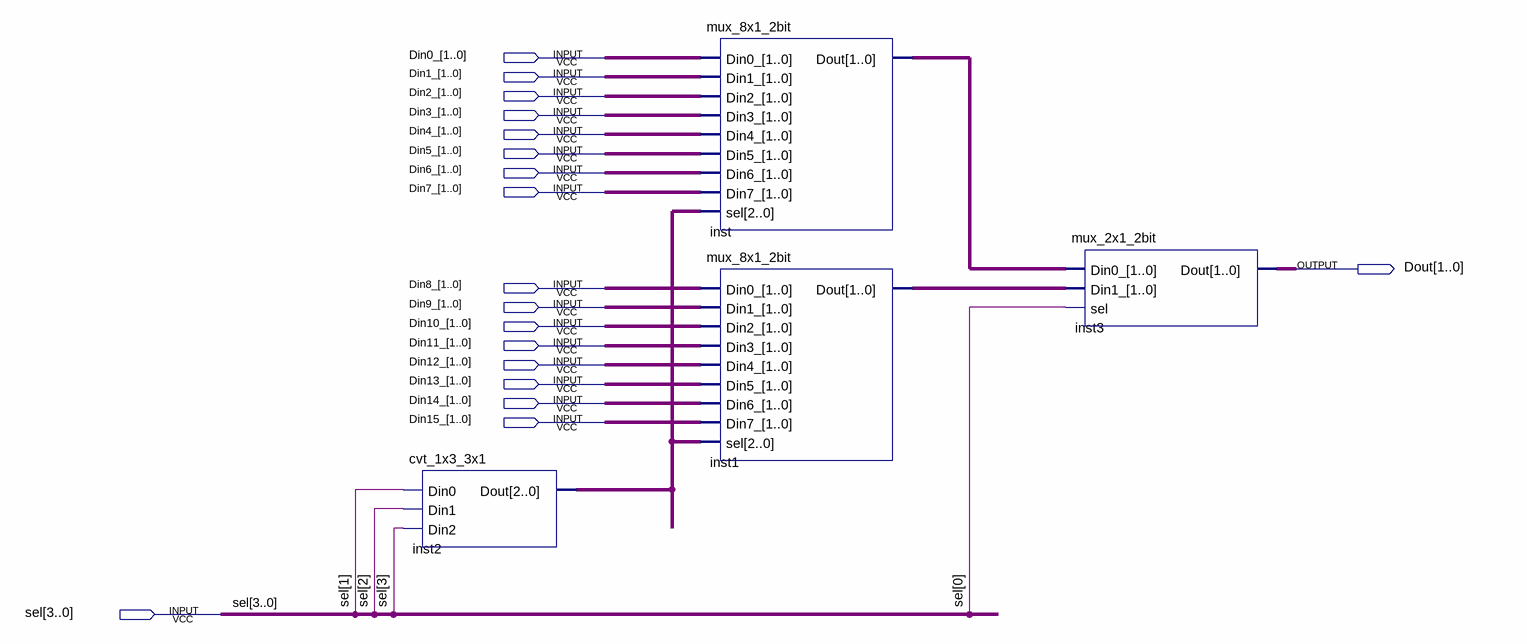
[diagram p0: schematic sheet]
// Quartus schematic mux_16x1_2bit.bdf as structural Verilog: 4 symbols, 18 pins
module mux_16x1_2bit (
  input  [1:0] Din0_,
  input  [1:0] Din1_,
  input  [1:0] Din2_,
  input  [1:0] Din3_,
  input  [1:0] Din4_,
  input  [1:0] Din5_,
  input  [1:0] Din6_,
  input  [1:0] Din7_,
  input  [1:0] Din8_,
  input  [1:0] Din9_,
  input  [1:0] Din10_,
  input  [1:0] Din11_,
  input  [1:0] Din12_,
  input  [1:0] Din13_,
  input  [1:0] Din14_,
  input  [1:0] Din15_,
  input  [3:0] sel,
  output [1:0] Dout
);

  wire [1:0] inst1_dout, inst_dout;
  wire [2:0] inst2_dout;

  cvt_1x3_3x1 inst2 (.Din0(sel[1]), .Din1(sel[2]), .Din2(sel[3]), .Dout(inst2_dout));
  mux_8x1_2bit inst (
    .Din0_(Din0_), .Din1_(Din1_), .Din2_(Din2_), .Din3_(Din3_), .Din4_(Din4_), .Din5_(Din5_), .Din6_(Din6_),
    .Din7_(Din7_), .sel(inst2_dout), .Dout(inst_dout));
  mux_8x1_2bit inst1 (
    .Din0_(Din8_), .Din1_(Din9_), .Din2_(Din10_), .Din3_(Din11_), .Din4_(Din12_), .Din5_(Din13_),
    .Din6_(Din14_), .Din7_(Din15_), .sel(inst2_dout), .Dout(inst1_dout));
  mux_2x1_2bit inst3 (.Din0_(inst_dout), .Din1_(inst1_dout), .sel(sel[0]), .Dout(Dout));
endmodule
